# Altium schematic sheet MCU_USB.SchDoc
size 297 x 209 mm; SheetNumber: 4; SheetTotal: 5
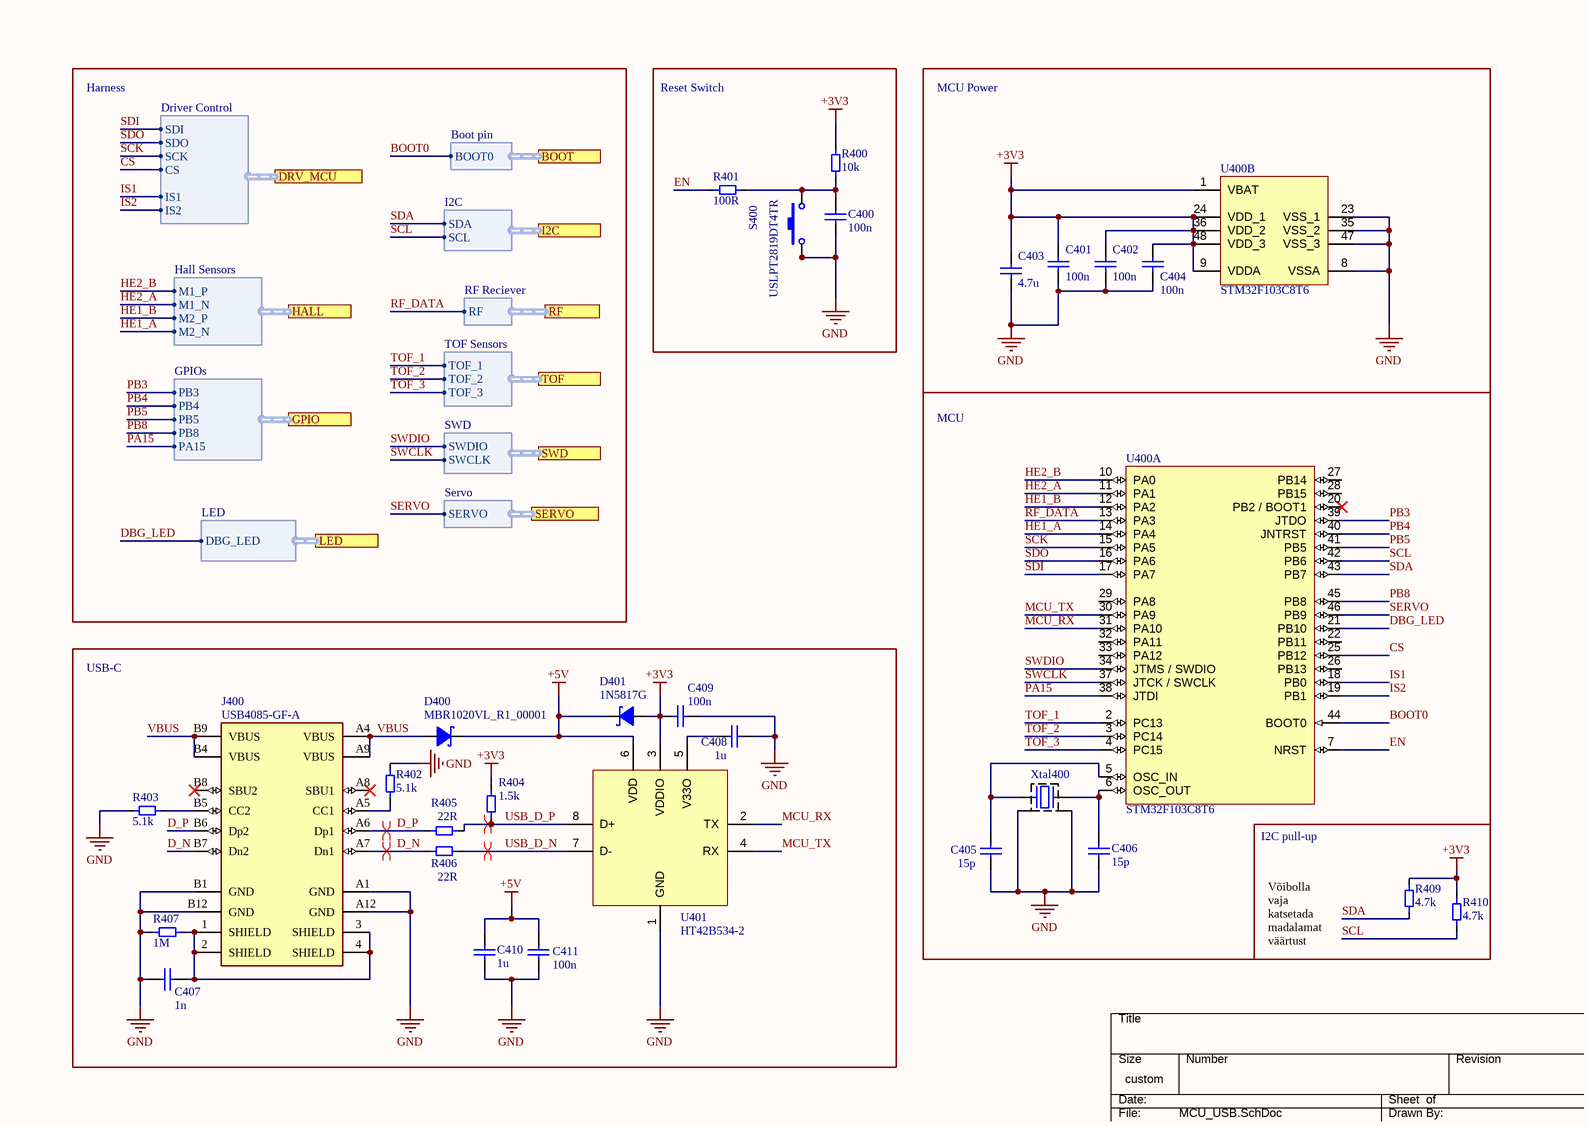
[diagram p0: MCU_USB.SchDoc]

## Parts
C400  100n  [MLCC_0603_M]
C401  100n  [MLCC_0603_M]
C402  100n  [MLCC_0603_M]
C403  4.7u  [MLCC_0805_M]
C404  100n  [MLCC_0603_M]
C405  15p  [MLCC_0402_M]
C406  15p  [MLCC_0402_M]
C407  1n  [MLCC_0603_M]
C408  1u  [MLCC_0603_M]
C409  100n  [MLCC_0603_M]
C410  1u  [MLCC_0603_M]
C411  100n  [MLCC_0603_M]
D400  MBR1020VL_R1_00001  [FP-MBR1020VL_R1_00001-MFG]
D401  1N5817G  [SOD-323 based on 1N5817WS]
J400  USB4085-GF-A  [FP-USB4085-GF-A-MFG]
R400  10k  [Resistor_0603_M]
R401  100R  [Resistor_0603_M]
R402  5.1k  [Resistor_0603_M]
R403  5.1k  [Resistor_0603_M]
R404  1.5k  [Resistor_0603_M]
R405  22R  [Resistor_0603_M]
R406  22R  [Resistor_0603_M]
R407  1M  [Resistor_1206_M]
R409  4.7k  [Resistor_0603_M]
R410  4.7k  [Resistor_0603_M]
S400  USLPT2819DT4TR  [USLPT2819DT4TR-Footprint-1]
U400  STM32F103C8T6  [STM-LQFP48_M]  (parts A,B of 2)
U401  HT42B534-2  [SOP-8 150mil]
Xtal400  ABM11-16.000MHZ-12-N1G-T  [FP-ABM11-MFG]  (value not drawn)

## Blocks framed on the sheet
Reset Switch: C400 R400 R401 S400
MCU Power: C401-C404 U400
MCU: C405 C406 U400 Xtal400
USB-C: C407-C411 D400 D401 J400 R402-R407 U401
I2C pull-up: R409 R410

## Ports
BOOT (harness Boot pin, see Overview[3C], Headers[3A]), DRV_MCU (harness Driver Control, see Overview[3B], Driver[6B]), GPIO (harness GPIOs, see Overview[3C], Headers[5A]), HALL (harness Hall Sensors, see Overview[3C], Headers[2A]), I2C (harness I2C, see Overview[3C], Headers[3A]), LED (harness LED, see Overview[3C], Power[2A]), RF (harness RF Reciever, see Overview[3C], Headers[3A]), SERVO (harness Servo, see Overview[3C], Headers[3A]), SWD (harness SWD, see Overview[3C], Headers[5A]), TOF (harness TOF Sensors, see Overview[3C], Headers[3A])

## Harnesses
Driver Control: SCK, SDO, IS1, SDI, IS2, CS
Hall Sensors: M1_P, M1_N, M2_P, M2_N
LED: DBG_LED
Boot pin: BOOT0
I2C: SDA, SCL
TOF Sensors: TOF_1, TOF_2, TOF_3
RF Reciever: RF
SWD: SWDIO, SWCLK
Servo: SERVO
GPIOs: PB4, PB5, PB8, PA15, PB3

## Nets
+3V3: C401.1 C402.1 C403.2 C404.1 C409.1 D401.2(A) R400.2 R404.2 R409.2 R410.2 U400.1(VBAT) U400.9(VDDA) U400.24(VDD_1) U400.36(VDD_2) U400.48(VDD_3) U401.3(VDDIO)
+5V: C410.2 C411.1 D400.1(C) D401.1(C) U401.6(VDD)
GND: C400.1 C401.2 C402.2 C403.1 C404.2 C405.1 C406.1 C407.1 C408.2 C409.2 C410.1 C411.2 J400.A1(GND) J400.A12(GND) J400.B1(GND) J400.B12(GND) R402.2 R403.1 R407.2 S400.1 S400.2 U400.8(VSSA) U400.23(VSS_1) U400.35(VSS_2) U400.47(VSS_3) U401.1(GND) Xtal400.2 Xtal400.4
BOOT0: U400.44(BOOT0) ; port BOOT.BOOT0
CS: U400.25(PB12) ; port DRV_MCU.CS
D_N: J400.A7(Dn1) J400.B7(Dn2) R406.1
D_P: J400.A6(Dp1) J400.B6(Dp2) R405.1
DBG_LED: U400.21(PB10) ; port LED.DBG_LED
EN: R401.2 U400.7(NRST)
HE1_A: U400.14(PA4) ; port HALL.M2_N
HE1_B: U400.12(PA2) ; port HALL.M2_P
HE2_A: U400.11(PA1) ; port HALL.M1_N
HE2_B: U400.10(PA0) ; port HALL.M1_P
IS1: U400.18(PB0) ; port DRV_MCU.IS1
IS2: U400.19(PB1) ; port DRV_MCU.IS2
MCU_RX: U400.31(PA10) U401.2(TX)
MCU_TX: U400.30(PA9) U401.4(RX)
PA15: U400.38(JTDI) ; port GPIO.PA15
PB3: U400.39(JTDO) ; port GPIO.PB3
PB4: U400.40(JNTRST) ; port GPIO.PB4
PB5: U400.41(PB5) ; port GPIO.PB5
PB8: U400.45(PB8) ; port GPIO.PB8
RF_DATA: U400.13(PA3) ; port RF.RF
SCK: U400.15(PA5) ; port DRV_MCU.SCK
SCL: R410.1 U400.42(PB6) ; port I2C.SCL
SDA: R409.1 U400.43(PB7) ; port I2C.SDA
SDI: U400.17(PA7) ; port DRV_MCU.SDI
SDO: U400.16(PA6) ; port DRV_MCU.SDO
SERVO: U400.46(PB9) ; port SERVO.SERVO
SWCLK: U400.37(JTCK_/_SWCLK) ; port SWD.SWCLK
SWDIO: U400.34(JTMS_/_SWDIO) ; port SWD.SWDIO
TOF_1: U400.2(PC13) ; port TOF.TOF_1
TOF_2: U400.3(PC14) ; port TOF.TOF_2
TOF_3: U400.4(PC15) ; port TOF.TOF_3
USB_D_N: R406.2 U401.7(D-)
USB_D_P: R404.1 R405.2 U401.8(D+)
VBUS: D400.2(A) J400.A4(VBUS) J400.A9(VBUS) J400.B4(VBUS) J400.B9(VBUS)
NetC400_2: C400.2 R400.1 R401.1 S400.3 S400.4
NetC405_2: C405.2 U400.5(OSC_IN) Xtal400.1
NetC406_2: C406.2 U400.6(OSC_OUT) Xtal400.3
NetC407_2: C407.2 J400.1(SHIELD) J400.2(SHIELD) J400.3(SHIELD) J400.4(SHIELD) R407.1
NetC408_1: C408.1 U401.5(V33O)
NetJ400_A5: J400.A5(CC1) R402.1
NetJ400_B5: J400.B5(CC2) R403.2

Not connected (* = marked no-connect by the designer): J400 A8(SBU1)* B8(SBU2)*; U400 20(PB2_/_BOOT1)* 22(PB11) 26(PB13) 27(PB14) 28(PB15) 29(PA8) 32(PA11) 33(PA12)

## Layout directives
differential pair: D_N, D_P, USB_D_N, USB_D_P

## Notes on the sheet
- Harness
- Võibolla vaja katsetada madalamat väärtust
- THIS DOCUMENT AND THE DATA DISCLOSED HEREIN OR
- HEREWITH IS THE PROPERTY OF ALTIUM LIMITED AND MAY
- DWG NO:
- REVISION
- REV:
- DESCRIPTION
- DATE
- APPROVED
- BE FREELY DISTRIBUTED IN WHOLE. NO RIGHTS ARE
- RESERVED OR EXPRESS OR IMPLIED WARANTEE GIVEN.
- ENG:
- APPROVALS
- PROJECT
- DSN:
- CHK:
- REFERENCE DOCUMENTS
- PROJECT REVISION:
- TITLE
- DOCUMENT REVISION:
- DESIGN ITEM:
- BOM:
- FAB DWG:
- PCB DWG:
- ASSY DWG:
- SCALE:
- A3
- SIZE
- CAGE CODE
- FILE NAME
- DWG NO.
- SHEET
- OF
- REV

## Library data of the parts
C400-C402 C404 C409 C411 = CMP-001-0815-1: MLCC, 0603, 100n, 10%, 50V, X7R; Manufacturer: Any; Value: 100nF; Capacitor Type: Ceramic; Part number: MLCC, 0603, 100n, 10%, 50V, X7R; RoHS: Yes; Dielectric: X7R; Mount: SMD; Voltage: 50V; Tolerance: 10%; Case/Package: 0603
C403 = CMP-001-1830-1: MLCC, 0805, 4.7u, 20%, 50V, X5R; Manufacturer: Any; Capacitor Type: Ceramic; Value: 4.7µF; Mount: SMD; Case/Package: 0805; Dielectric: X5R; RoHS: Yes; Part number: MLCC, 0805, 4.7u, 20%, 50V, X5R; Voltage: 50V; Tolerance: 20%
C405 C406 = CMP-001-1853-1: MLCC, 0402, 15p, 10%, 25V, C0G/NP0; Manufacturer: Any; Capacitor Type: Ceramic; Voltage Rating: 25; Value: 15pF; Dielectric: C0G; Temperature Coefficient: 300ppm/°C; Height: 0.5mm; Width: 0.02inch; Contact Plating: Tin; Package Quantity: 1; Case/Package: 0402; Depth: 0.5mm; Material: Ceramic; Packaging: Tape and Reel; Radiation Hardening: No; Case Code (Imperial): 0402; Min Operating Temperature: -55°C; Mount: Surface Mount; RoHS: Yes; Length: 1mm; Thickness: 0.022inch; Part number: MLCC, 0402, 15p, 10%, 25V, C0G/NP0; Capacitance: 15pF; Tolerance: 10%; Case Code (Metric): 1005; Voltage: 25V; Max Operating Temperature: 125°C
C407 = CMP-001-0547-1: MLCC, 0603, 1n, 10%, 50V, X5R; Manufacturer: Any; Capacitor Type: Ceramic; Value: 1nF; Case/Package: 0603; Part number: MLCC, 0603, 1n, 10%, 50V, X5R; RoHS: Yes; Dielectric: X5R; Mount: SMD; Tolerance: 10%; Voltage: 50V
C408 C410 = CMP-001-0565-1: MLCC, 0603, 1u, 10%, 50V, X5R; Manufacturer: Any; Capacitor Type: Ceramic; Value: 1µF; Part number: MLCC, 0603, 1u, 10%, 50V, X5R; Dielectric: X5R; Voltage: 50V; RoHS: Yes; Tolerance: 10%; Mount: SMD; Case/Package: 0603
D400 = CMP-ROOT-01310-1: Rectifier Diode, Schottky, 1 Phase, 1 Element, 1A, 20V V(RRM), Silicon; Manufacturer: Panjit; Max Forward Surge Current (Ifsm): 45A; Max Junction Temperature (Tj): 125°C; Number of Elements: 1; Peak Reverse Current: 600µA; Case/Package: SOD-123FL; Mount: SMD; Part number: MBR1020VL_R1_00001; Pins: 2; RoHS: Compliant; Forward Current: 1A; Height: 1.1mm; Lifecycle Status: Production; Max Operating Temperature: 125°C; Max Output current: 1A; Max Repetitive Reverse Voltage (Vrrm): 20V; Min Operating Temperature: -55°C; Number of Terminals: 2; REACH SVHC: No; Reverse Standoff Voltage: 20V
D401 = CMP-ROOT-01323-1: Rectifier Diode, Schottky, 1 Phase, 1 Element, 1A, 20V V(RRM), Silicon, DO-204AL; Manufacturer: TWGMC / onsemi; Part number: 1N5817WS; Manufacturer Lifecycle Status: ACTIVE; Element Configuration: Single; Forward Voltage: 320mV; Max Forward Surge Current (Ifsm): 25A; Number of Elements: 1; Peak Reverse Current: 1mA; Polarity: Standard; Case/Package: Axial; Mount: SMD; Pins: 2; RoHS: Compliant; Average Rectified Current: 1A; Breakdown Voltage: 20V; China RoHS: Non-Compliant; Country of Origin: Mainland China; Current Rating: 1A; Diameter: 2.7mm; Export Control Classification Number (ECCN) Code: EAR99; Forward Current: 1A; Halogen Free: Halogen Free; Harmonized Tariff Schedule (HTS) Code: 8541.10.00.80; Height: 2.7mm; Introduction Date: 1997-05-06; Lead Free: Lead Free; Length: 5.1816mm; Lifecycle Status: Production; Max Operating Temperature: 125°C; Max Output current: 1A; Max Repetitive Reverse Voltage (Vrrm): 20V; Max Reverse Voltage (DC): 20V; Min Operating Temperature: -65°C; Number of Terminals: 2; Output Current: 1A; Packaging: Bulk; Peak Non-Repetitive Surge Current: 25A; REACH SVHC: No; Radiation Hardening: No; Reverse Standoff Voltage: 20V; Schedule B: 8541100080, 8541100080; Voltage Rating (DC): 20V; Weight: 4.535924g; Width: 2.7mm
J400 = CMP-001-1800-1: USB Connector, 16 Contact(s), Female, Right Angle, Solder Terminal, Locking, Receptacle; Manufacturer: GCT; Part number: USB4800-03-A; USB Standard: USB 2.0; Standoff Height: 3.5mm; USB PD: 3.2; Current Rating: 4.25A; Mating Cycles: 10000; Number of Contacts: 16; Number of Ports: 1; Shielding: Shielded; Voltage Rating: 20V; RoHS: Yes; Pins: 16; Mount: TH; Connector Type: USB; Contact Material: Copper Alloy; Contact Plating: Gold; Flammability Rating: UL94 V-0; Gender: Receptacle; Height: 3.66mm; Insulation Color: Black; Max Operating Temperature: 85°C; Min Operating Temperature: -40°C; Mounting Technology: Through Hole,Horizontal; Number of Positions: 16; Orientation: Right Angle; Packaging: Tape and Reel; Series: USB4085; Termination: Solder
R400 = CMP-001-0101-2: Resistor, 0603, 10k, 1%, 1/10W; Manufacturer: Any; Power: 100mW; Tolerance: 1%; Value: 10k; RoHS: Yes; Mount: SMD; Case/Package: 0603; Part number: Resistor, 0603, 10k, 1%, 1/10W
R401 = CMP-001-0054-5: Resistor, 0603, 100R, 1%, 1/10W; Manufacturer: Any; Value: 100; Power: 100mW; Case/Package: 0603; Mount: SMD; Part number: Resistor, 0603, 100R, 1%, 1/10W; Tolerance: 1%; RoHS: Yes
R402 R403 = CMP-001-0094-2: Resistor, 0603, 5.1k, 1%, 1/10W; Manufacturer: Any; Power: 100mW; Value: 5,1k; Case/Package: 0603; Part number: Resistor, 0603, 5.1k, 1%, 1/10W; Mount: SMD; Tolerance: 1%; RoHS: Yes
R404 = CMP-001-0081-2: Resistor, 0603, 1.5k, 1%, 1/10W; Manufacturer: Any; Power: 100mW; Value: 1,5k; Case/Package: 0603; Mount: SMD; RoHS: Yes; Part number: Resistor, 0603, 1.5k, 1%, 1/10W; Tolerance: 1%
R405 R406 = CMP-001-0038-3: Resistor, 0603, 22R, 1%, 1/10W; Manufacturer: Any; Value: 22; Power: 100mW; Part number: Resistor, 0603, 22R, 1%, 1/10W; Tolerance: 1%; Case/Package: 0603; Mount: SMD; RoHS: Yes
R407 = CMP-0001-00051-1: Resistor, 1206, 1M, 1%, 1/4W; Manufacturer: Any; Case/Package: 1206; RoHS: Yes; Value: 1M; Mount: SMD; Part number: Any
R409 R410 = CMP-001-0093-2: Resistor, 0603, 4.7k, 1%, 1/10W; Manufacturer: Any; Power: 100mW; Value: 4,7k; Part number: Resistor, 0603, 4.7k, 1%, 1/10W; Case/Package: 0603; RoHS: Yes; Tolerance: 1%; Mount: SMD
S400 = CMP-ROOT-01290-1: Keypad Switch, SPST, 0.05A, 1.96N, Solder Terminal, Panel Mount; Manufacturer: TE Connectivity ALCOSWITCH Switches; Contact Current Rating: 50mA; Case/Package: Non-standard; Mount: SMD; Part number: USLPT2819DT4TR; RoHS: Compliant; China RoHS: Compliant; Color: Black; Contact Material: Stainless Steel; Contact Plating: Silver; Housing Material: Polyethylene; Lifecycle Status: Production; Max Current Rating: 50mA; Max Operating Temperature: 85°C; Min Operating Temperature: -40°C; Operating Force: 1.96N; Packaging: Tape & Reel; REACH SVHC: Yes; Throw Configuration: SPST
U400 = CMP-00012-3: MCU 32-bit STM32F1 ARM Cortex M3 RISC 64KB Flash 2.5V/3.3V 48-Pin LQFP Tray; Manufacturer: STMicroelectronics; Manufacturer Package Identifier: ai14911d; Address Bus Width: 32b; Frequency: 72MHz; Interface: CAN, USB; Clock Frequency: 16MHz; Max Power Dissipation: 363mW; Max Supply Current: 50mA; Max Supply Voltage: 3.6V; Min Supply Voltage: 2V; Nominal Supply Current: 1.7µA; Number of A/D Converters: 2; Number of ADC Channels: 10; Number of I/Os: 37; Number of Programmable I/O: 48; Number of Timers/Counters: 4; Number of USART Channels: 3; Operating Supply Voltage: 3.3V; Oscillator Type: Internal; Peripherals: POR; RAM Size: 20kB; Watchdog Timer: Yes; ADC Channels (Resolution): 10-Ch 12-Bit; Density: 512kb; EEPROM Memory Size: 0B; Number of Bits: 32; Number of Interrupts: 16; Number of PWM Channels: 1; Case/Package: LQFP; China RoHS: Compliant; Core Architecture: ARM; Data Bus Width: 32b; Flash Memory Size: 64kB; Height: 1.45mm; Lead Free: Lead Free; Length: 7mm; Lifecycle Status: Production; Max Operating Temperature: 85°C; Memory Size: 64kB; Memory Format: FLASH; Min Operating Temperature: -40°C; Number of Channels: 10; Number of I2C Channels: 2; Pins: 48; Number of SPI Channels: 2; Number of Terminals: 48; REACH SVHC: Yes; Radiation Hardening: No; RoHS: Compliant; Schedule B: 8542310000; Terminal Pitch: 500µm; Width: 7mm; Mount: SMD; Part number: STM32F103C8T6; Height - Seated (Max): 1.6mm; Mounting Technology: Surface Mount; Termination: SMD/SMT
U401 = CMP-00027-2: USB to UART 3Mbps USB 2.0 SOP-8 Interface Controllers RoHS; Manufacturer: HOLTEK; Harmonized Tariff Schedule (HTS) Code: 8542.31.00.30; Introduction Date: 2019-03-26; Lifecycle Status: NRND; Case/Package: SOP-8; Mount: SMD; Part number: HT42B534-2; Pins: 8; RoHS: Yes
Xtal400 = CMP-ROOT-01254-3: Crystal 16MHz ±10ppm (Tol) ±15ppm (Stability) 12pF FUND 150Ohm 4-Pin Ultra Mini-CSMD T/R; Manufacturer: Abracon LLC; ESR (Equivalent Series Resistance): 150Ω; Frequency Tolerance: 0.001%; Case/Package: 4-SMD, No Lead; Mount: SMD; RoHS: Compliant; China RoHS: Compliant; Frequency: 16MHz; Frequency Stability: 15ppm; Height: 590µm; Length: 2mm; Lifecycle Status: Production; Load Capacitance: 12pF; Max Operating Temperature: 85°C; Min Operating Temperature: -30°C; Mounting Technology: Surface Mount; REACH SVHC: Yes; Schedule B: 8541600080; ESR: 150Ω; Tolerance: 0.001%; Width: 1.6mm